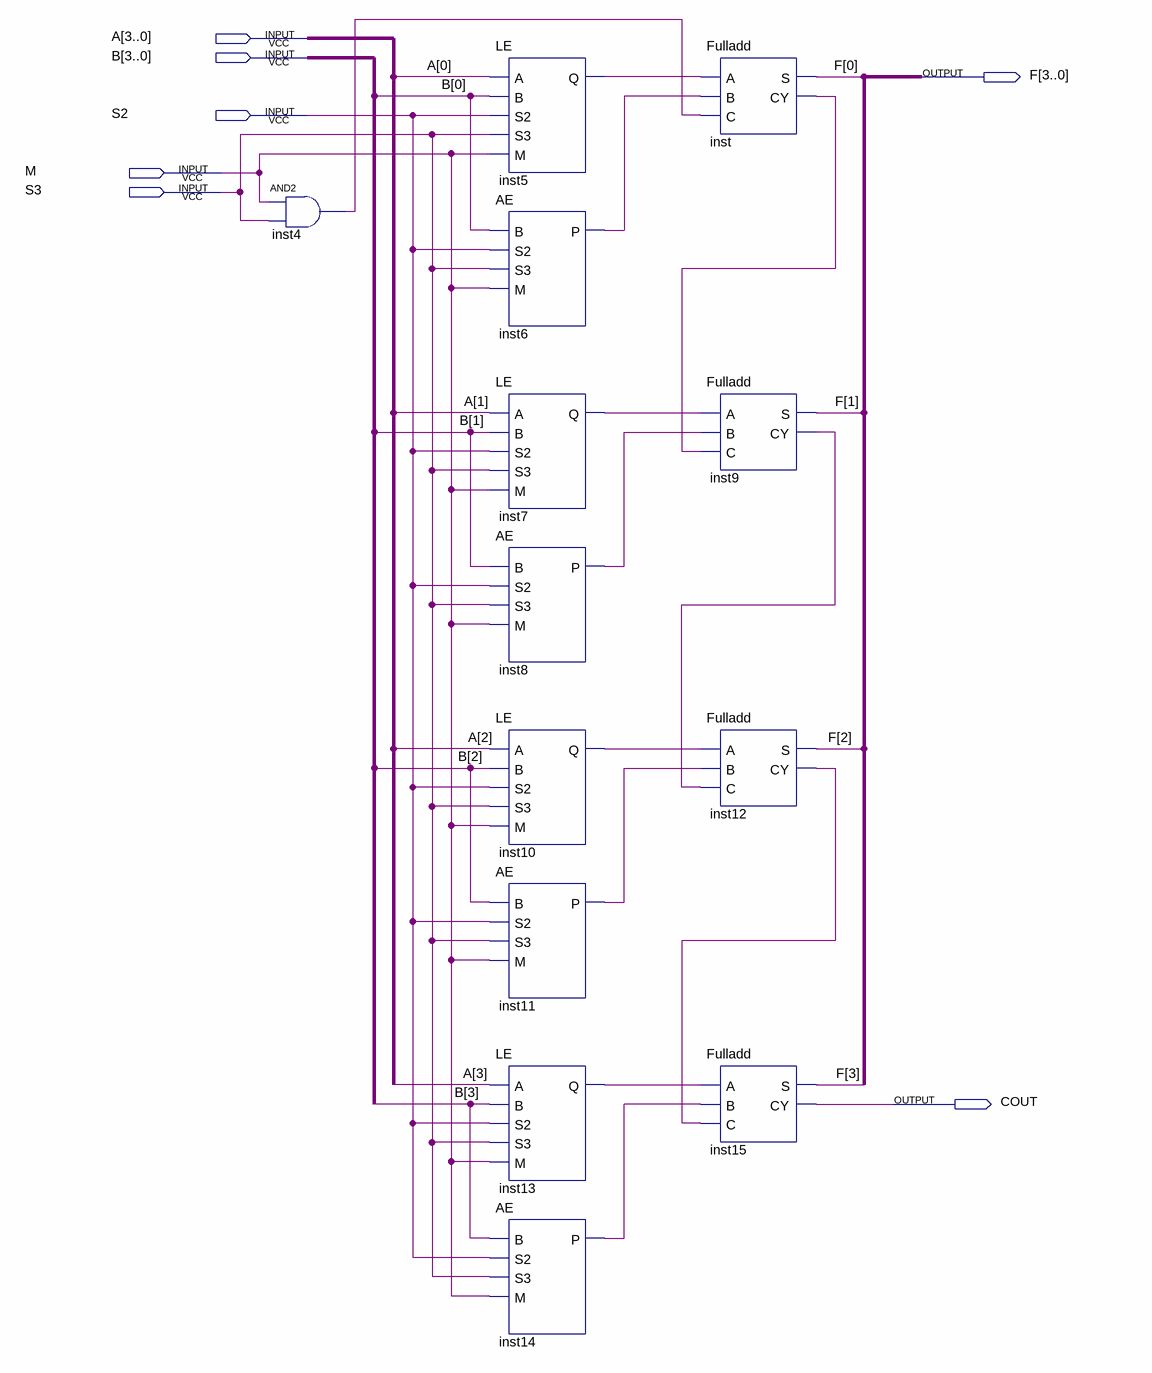
[diagram p0: schematic sheet]
// Quartus schematic ALU.bdf as structural Verilog: 13 symbols, 7 pins
module ALU (
  input  [3:0] A,
  input  [3:0] B,
  input  S2,
  input  M,
  input  S3,
  output [3:0] F,
  output COUT
);

  wire inst4_out, inst5_q, inst6_p, inst7_q, inst8_p, inst9_cy, inst10_q, inst11_p, inst12_cy, inst13_q,
       inst14_p, inst_cy;

  and inst4 (inst4_out, M, S3);
  LE inst5 (.A(A[0]), .B(B[0]), .S2(S2), .S3(S3), .M(M), .Q(inst5_q));
  AE inst6 (.B(B[0]), .S2(S2), .S3(S3), .M(M), .P(inst6_p));
  LE inst7 (.A(A[1]), .B(B[1]), .S2(S2), .S3(S3), .M(M), .Q(inst7_q));
  AE inst8 (.B(B[1]), .S2(S2), .S3(S3), .M(M), .P(inst8_p));
  LE inst10 (.A(A[2]), .B(B[2]), .S2(S2), .S3(S3), .M(M), .Q(inst10_q));
  AE inst11 (.B(B[2]), .S2(S2), .S3(S3), .M(M), .P(inst11_p));
  LE inst13 (.A(A[3]), .B(B[3]), .S2(S2), .S3(S3), .M(M), .Q(inst13_q));
  AE inst14 (.B(B[3]), .S2(S2), .S3(S3), .M(M), .P(inst14_p));
  Fulladd inst (.A(inst5_q), .B(inst6_p), .C(inst4_out), .S(F[0]), .CY(inst_cy));
  Fulladd inst9 (.A(inst7_q), .B(inst8_p), .C(inst_cy), .S(F[1]), .CY(inst9_cy));
  Fulladd inst12 (.A(inst10_q), .B(inst11_p), .C(inst9_cy), .S(F[2]), .CY(inst12_cy));
  Fulladd inst15 (.A(inst13_q), .B(inst14_p), .C(inst12_cy), .S(F[3]), .CY(COUT));
endmodule
